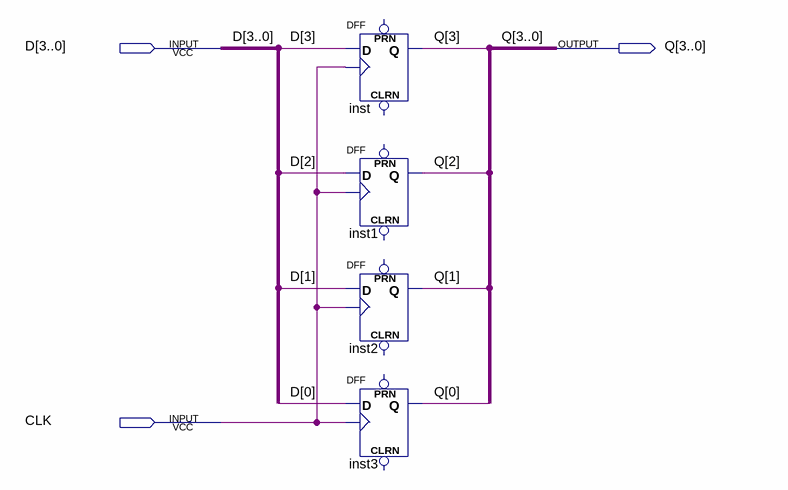
[diagram p0: schematic sheet]
// Quartus schematic Current_State.bdf as structural Verilog: 4 symbols, 3 pins
module Current_State (
  input  [3:0] D,
  input  CLK,
  output [3:0] Q
);

  DFF inst (.CLK(CLK), .D(D[3]), .Q(Q[3]));  // open: CLRN, PRN
  DFF inst1 (.CLK(CLK), .D(D[2]), .Q(Q[2]));  // open: CLRN, PRN
  DFF inst2 (.CLK(CLK), .D(D[1]), .Q(Q[1]));  // open: CLRN, PRN
  DFF inst3 (.CLK(CLK), .D(D[0]), .Q(Q[0]));  // open: CLRN, PRN
endmodule
